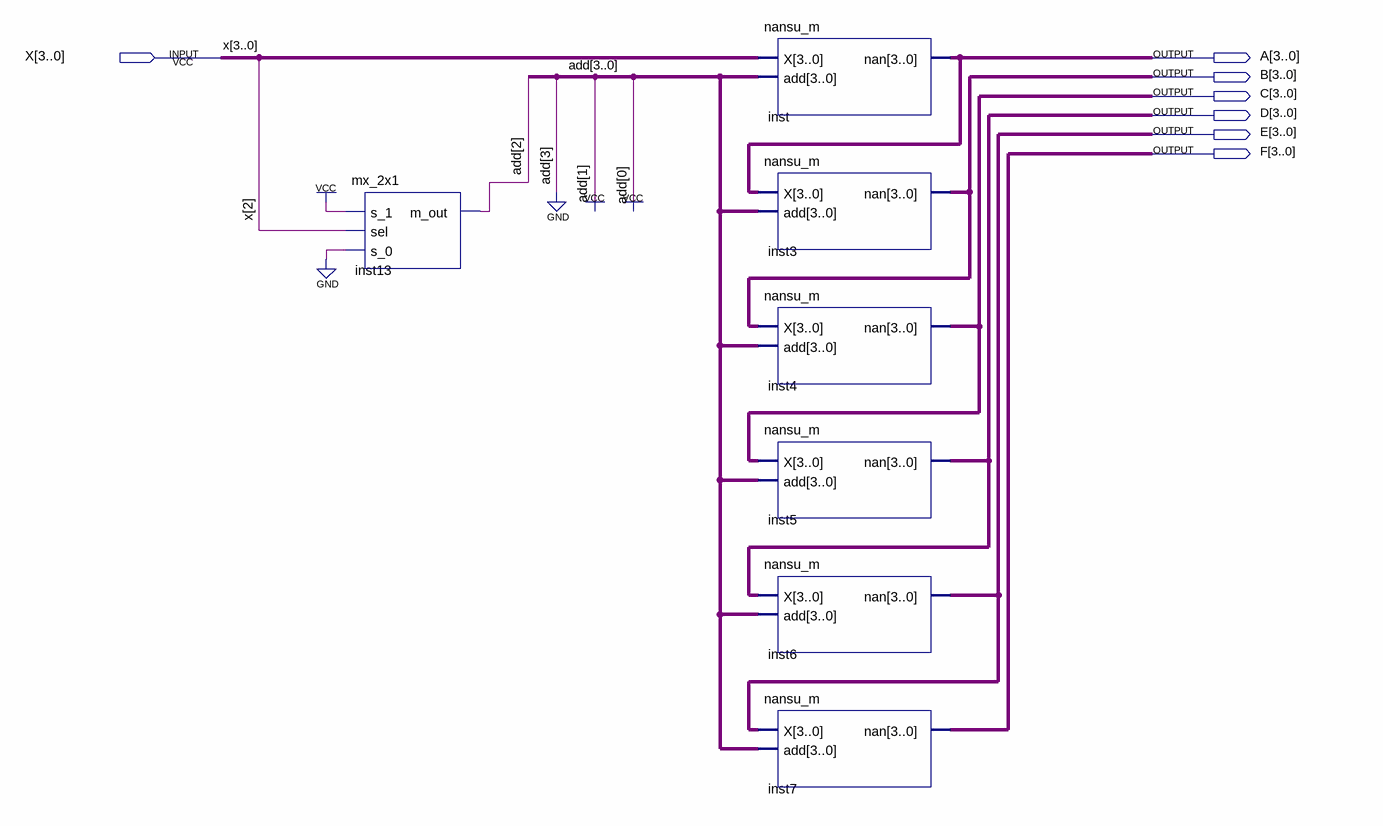
[diagram p0: schematic sheet]
// Quartus schematic nansu.bdf as structural Verilog: 7 symbols, 7 pins
module nansu (
  input  [3:0] X,
  output [3:0] A,
  output [3:0] B,
  output [3:0] C,
  output [3:0] D,
  output [3:0] E,
  output [3:0] F
);

  wire [2:2] add;

  mx_2x1 inst13 (.s_1(1'b1), .sel(X[2]), .s_0(1'b0), .m_out(add[2]));
  nansu_m inst (.X(X), .add({1'b0, add[2], 2'b11}), .nan(A));
  nansu_m inst3 (.X(A), .add({1'b0, add[2], 2'b11}), .nan(B));
  nansu_m inst4 (.X(B), .add({1'b0, add[2], 2'b11}), .nan(C));
  nansu_m inst5 (.X(C), .add({1'b0, add[2], 2'b11}), .nan(D));
  nansu_m inst6 (.X(D), .add({1'b0, add[2], 2'b11}), .nan(E));
  nansu_m inst7 (.X(E), .add({1'b0, add[2], 2'b11}), .nan(F));
endmodule
